# Altium schematic sheet Flyback_SMPS.SchDoc
size A; SheetNumber: 1; SheetTotal: 1
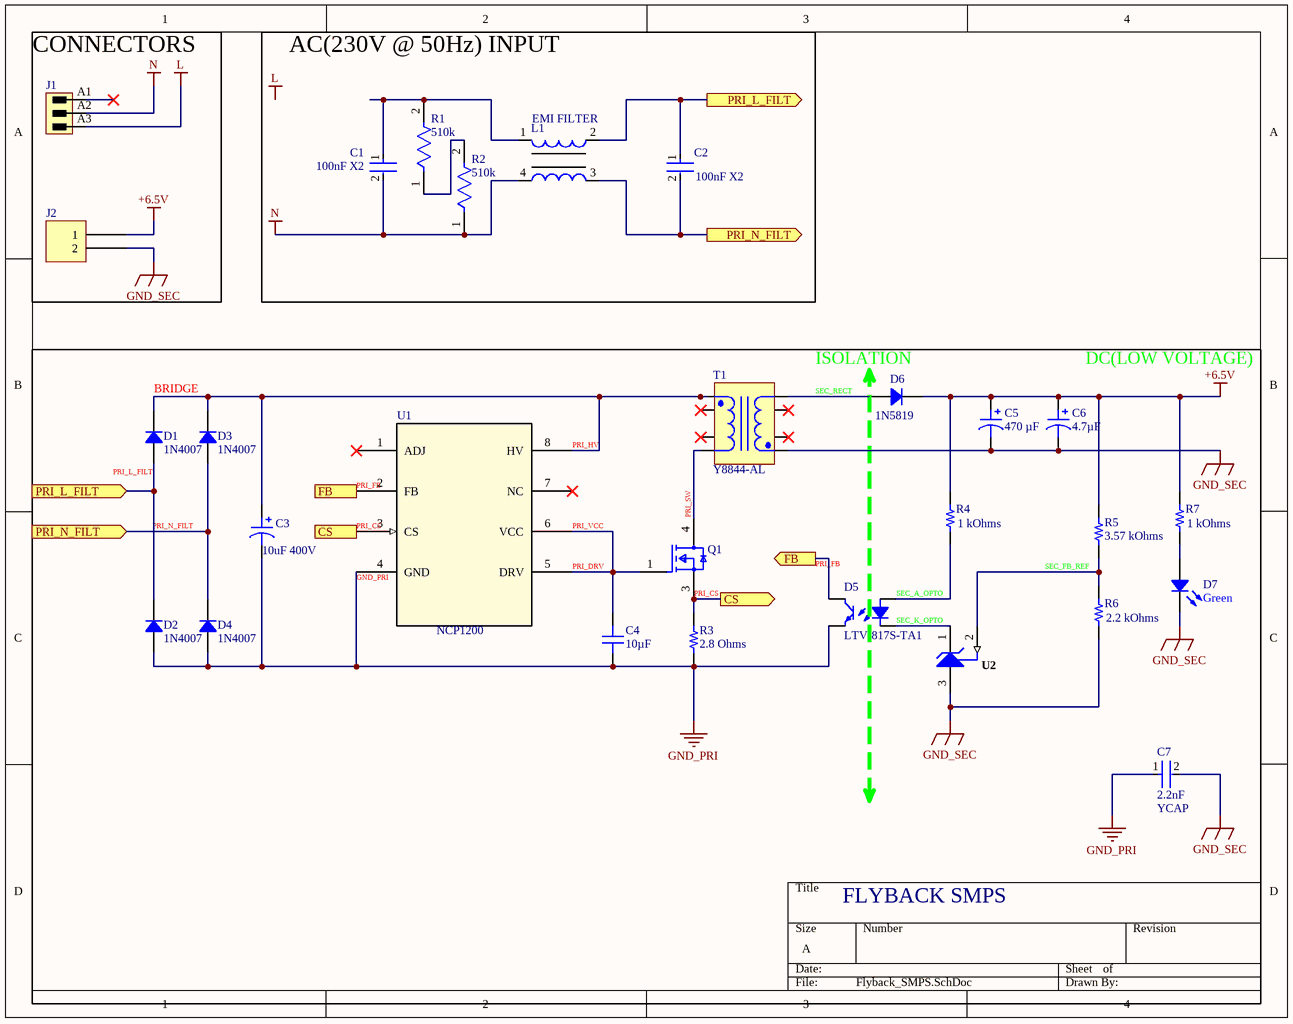
[diagram p0: Flyback_SMPS.SchDoc]

## Parts
C1  100nF X2  [FP-R46KI3100JBM1K-MFG]
C2  100nF X2  [FP-R46KI3100JBM1K-MFG]
C3  10uF 400V  [CAP TH ALUM ELEC D10.00mm S5.00mm H17.50mm]
C4  10µF  [CAP 1206_3216 - 1.8MM]
C5  470 µF  [CAP AL TH D8 L3.5 H12.5]
C6  4.7µF  [CAP TH ALUM ELEC D4.00mm S1.50mm H6.00mm]
C7  YCAP  value 2.2nF  [Vishay_0_MFG]
D1  1N4007  [SOD123F]
D2  1N4007  [SOD123F]
D3  1N4007  [SOD123F]
D4  1N4007  [SOD123F]
D5  LTV-817S-TA1  [LITEON LTV-817]
D6  1N5819  [SOD-123]
D7  Green  [LED 0603_1608 GREEN]
J1  1146740000  [SL_5_08HC_90_03]  (value not drawn)
J2  282837-2  [TE 282837-2]  (value not drawn)
L1  744823305  [WE-CMB-M]  (value not drawn)
Q1  STD1NK60T4  [STMicroelectronics_DPAK_TO-252_-0068772_MFG]  (value not drawn)
R1  510k  [FP-CR1206-IPC_A]
R2  510k  [FP-CR1206-IPC_A]
R3  2.8 Ohms  [RES 1206_3216]
R4  1 kOhms  [RES 0402_1005]
R5  value 3.57 kOhms  [YAGEO RES 1206_3216]  (hidden comment: 220 Ohms)
R6  2.2 kOhms  [RES 0402_1005]
R7  1 kOhms  [RES 0402_1005]
T1  Y8844-AL  [COIL-Y8844-AL-8_V]
U1  NCP1200  [SOIC8_ONS]
U2  TL431AQDBZRQ1  [DBZ0003A_L]  (value not drawn)

## Blocks framed on the sheet
CONNECTORS: J1 J2
AC(230V @ 50Hz) INPUT: C1 C2 L1 R1 R2
FLYBACK SMPS: C3-C7 D1-D7 Q1 R3-R7 T1 U1 U2

## Ports
CS (in, see Sheet1[3C]), CS (out, see Sheet1[1C]), FB (in, see Sheet1[3C]), FB (out, see Sheet1[1B]), PRI_L_FILT (in, see Sheet1[3A]), PRI_L_FILT (out, see Sheet1[1B]), PRI_N_FILT (in, see Sheet1[3A]), PRI_N_FILT (out, see Sheet1[1C])

## Nets
+6.5V: C5.1 C6.1 D6.2 J2.1 R4.2 R5.2 R7.2
GND_PRI: C3.2 C4.2 C7.1 D2.1 D4.1 D5.3 R3.1 U1.4(GND)
GND_SEC: C5.2 C6.2 C7.2 D7.2 J2.2 R6.1 T1.1 U2.3(ANODE)
L: J1.A3
N: C1.2 J1.A2 L1.4 R2.1
PRI_CS: Q1.3(S) R3.2 U1.3(CS) ; port CS
PRI_DRV: C4.1 Q1.1(G) U1.5(DRV) U1.6(VCC)
PRI_FB: D5.4 U1.2(FB) ; port FB
PRI_HV: C3.1 D1.2 D3.2 T1.8 U1.8(HV)
PRI_L_FILT: C2.1 D1.1 D2.2 L1.2 ; port PRI_L_FILT
PRI_N_FILT: C2.2 D3.1 D4.2 L1.3 ; port PRI_N_FILT
PRI_SW: Q1.4(D) T1.5
SEC_A_OPTO: D5.1 R4.1
SEC_FB_REF: R5.1 R6.2 U2.2(REF)
SEC_K_OPTO: D5.2 U2.1(CATHODE)
SEC_RECT: D6.1 T1.4
NetC1_1: C1.1 L1.1 R1.2
NetD7_1: D7.1 R7.1
NetR1_1: R1.1 R2.2

Not connected (* = marked no-connect by the designer): J1 A1*; T1 2* 3* 6* 7*; U1 1(ADJ)* 7(NC)*

## Notes on the sheet
- (near L1) EMI FILTER
- (near D6) ISOLATION
- (near C6) DC(LOW VOLTAGE)
- BRIDGE
- (near U1) PRI_VCC
- Labels drawn without touching a wire or pin: L

## Library data of the parts
C1 C2 = CMP-03022-000055-1: CAP FILM 0.1UF 10% 560VDC RADIAL; Dielectric: PP; Lead Diameter: 0.6mm; Voltage Rating (AC): 275V; Voltage Rating (DC): 560V; Mount: Through Hole; Capacitance: 100nF; Series: R46; Height - Seated (Max): 0.433inch; Depth: 5mm; Packaging: Bulk; RoHS Compliant: Yes; Case/Package: Radial; Ratings: X2; Termination: PC Pins; Tolerance: 10%; Lead Pitch: 15mm; Package Quantity: 2000; Dielectric Material: PP; Max Operating Temperature: 110°C; Height: 5mm; Min Operating Temperature: -40°C; Width: 11mm; Length: 18mm
C3 = 860241375002: CAP 10 UF 20% 400 V; manufacturer: Würth Elektronik; Capacitance: 10µF; Lifetime @ Temp.: 10000 Hrs @ 105°C; Polarization: Polar; Ripple Current @ High Frequency: 274mA @ 100kHz; Ripple Current @ Low Frequency: 137mA @ 120Hz; value: 10µF; Part Number: 860241375002; Applications: General Purpose; componentlink1description: Datasheet; componentlink1url: https://katalog.we-online.de/pbs/datasheet/860241375002.pdf; componentlink2description: DigiKey Link; componentlink2url: http://digikey.com/product-detail/en/w-rth-elektronik/860241375002/732-9301-1-ND/5729239; Device Package: Radial, Can; Height - Seated (Max): 0.689" (17.50mm); lastupdated: 9/2/2020 1:31:25 AM; Lead Spacing: 0.197" (5.00mm); Lifecycle Status: Active; Minimum Order: 1; Mounting Type: Through Hole; Operating Temperature: -25°C ~ 105°C; Package / Case: Radial, Can; packaging: TapeAndBox; partid: 12069; Part Status: Active; price: 0.48; series: WCAP-AT1H; Size / Dimension: 0.394" Dia (10.00mm); Supplier 1: DigiKey; Supplier Part Number 1: 732-9301-1-ND; Tolerance: ±20%; Voltage - Rated: 400V
C4 = 12065D106KAT2A: CAP CER 10UF 50V X5R 1206; manufacturer: AVX Corporation; Tolerance: ±10%; Part Number: 12065D106KAT2A; Capacitance: 10µF; Applications: General Purpose; componentlink1description: Datasheet; componentlink1url: http://datasheets.avx.com/cx5r.pdf; componentlink2description: DigiKey Link; componentlink2url: http://digikey.com/product-detail/en/avx-corporation/12065D106KAT2A/478-9979-1-ND/6149060; Device Package: 1206 (3216 Metric); lastupdated: 9/2/2020 1:05:35 AM; Lifecycle Status: Active; Minimum Order: 1; Mounting Type: Surface Mount, MLCC; Operating Temperature: -55°C ~ 85°C; Package / Case: 1206 (3216 Metric); packaging: TapeAndReel; partid: 21345; Part Status: Active; price: 0.16; series: -; Size / Dimension: 0.126" L x 0.063" W (3.20mm x 1.60mm); Supplier 1: DigiKey; Supplier Part Number 1: 478-9979-1-ND; Temperature Coefficient: X5R; Thickness (Max): 0.071" (1.80mm); value: 10µF; Voltage - Rated: 50V
C5 = UKW1C471MPD1TD: CAP ALUM 470UF 20% 16V RADIAL; manufacturer: Nichicon; Lifetime @ Temp.: 2000 Hrs @ 85°C; Polarization: Polar; Ripple Current @ Low Frequency: 420 mA @ 120 Hz; Part Number: UKW1C471MPD1TD; Applications: Audio; Capacitance: 470 µF; componentlink1description: Datasheet; componentlink1url: http://nichicon-us.com/english/products/pdfs/e-ukw.pdf; componentlink2description: DigiKey Link; componentlink2url: https://www.digikey.com/en/products/detail/nichicon/UKW1C471MPD1TD/4317336; Device Package: Radial, Can; Height - Seated (Max): 0.492" (12.50mm); lastupdated: 6/3/2024 8:06:12 PM; Lead Spacing: 0.138" (3.50mm); Lifecycle Status: Active; Minimum Order: 1; Mounting Type: Through Hole; Operating Temperature: -40°C ~ 85°C; Package / Case: Radial, Can; packaging: TapeAndBox; partid: 7216; Part Status: Active; price: 0.23; series: UKW; Size / Dimension: 0.315" Dia (8.00mm); Supplier 1: DigiKey; Supplier Part Number 1: 493-10758-1-ND; Tolerance: ±20%; value: 470 µF; Voltage - Rated: 16 V
C6 = UMP1C4R7MDD1TP: CAP ALUM 4.7UF 20% 16V RADIAL; manufacturer: Nichicon; Lifetime @ Temp.: 2000 Hrs @ 85°C; Polarization: Bi-Polar; Ripple Current @ High Frequency: 18mA @ 10kHz; Ripple Current @ Low Frequency: 12mA @ 120Hz; Part Number: UMP1C4R7MDD1TP; Applications: General Purpose; Capacitance: 4.7µF; componentlink1description: Datasheet; componentlink1url: http://nichicon-us.com/english/products/pdfs/e-ump.pdf; componentlink2description: DigiKey Link; componentlink2url: http://digikey.com/product-detail/en/nichicon/UMP1C4R7MDD1TP/493-10248-1-ND/4312507; Device Package: Radial, Can; Height - Seated (Max): 0.236" (6.00mm); lastupdated: 9/6/2020 1:48:30 AM; Lead Spacing: 0.059" (1.50mm); Lifecycle Status: Active; Minimum Order: 1; Mounting Type: Through Hole; Operating Temperature: -40°C ~ 85°C; Package / Case: Radial, Can; packaging: TapeAndBox; partid: 23164; Part Status: Active; price: 0.11; series: UMP; Size / Dimension: 0.157" Dia (4.00mm); Supplier 1: DigiKey; Supplier Part Number 1: 493-10248-1-ND; Tolerance: ±20%; value: 4.7µF; Voltage - Rated: 16V
C7 = CMP-001-00084-1: 2200 pF ±20% 500VAC Ceramic Capacitor Y5V (F) Radial, Disc; Manufacturer: Vishay; Symbol Hash: 02cd4be3c70576c341d710602a673aaf100b1e689dd796f6d4934cc5521dd216; Vac Y Rating: Y1; Voltage Rating: 1.5kV; Voltage Ac Rating X: 760V; Vac X Rating: X1; Verification Version: 0.0.0.3; Voltage Ac Rating Y: 500V; Tolerance: 20%; Datasheet Path: datasheets/Cap_Vishay_VY1222M37Y5VQ63V0_eec.pdf; Temperature Range High: 125°C; Automotive: No; helpURL: https://upverter.com/part/id/97ca20b8586b3509/; Lead Free: Yes; Temperature: -40°C to +125°C; Height: 24.5mm; ComponentLink2URL: https://www.vishay.com/docs/28537/vy1series.pdf; ComponentLink1URL: https://upverter.com/part/id/97ca20b8586b3509/; RoHS: TRUE; Mouser Description: VY1 Ceramic Capacitor 2 2NF 20% Y5V; Temperature Range Low: -40°C; Material: Ceramic; Digikey Part Number: BC3303-ND; Digikey Description: CAP CER 2200PF 500VAC Y5V RADIAL; Mouser Part Number: 72-VY1222M37Y5VQ63V0; Part Number: VY1222M37Y5VQ63V0; Case/Package: 0; Temperature Characteristic: Y5V; ComponentLink1Description: Upverter; ComponentLink2Description: Datasheet
D1-D4 = 1N4007FLTR: STANDARD RECTIFIER 1000V SOD-123; Manufacturer: SMC Diode Solutions; Capacitance @ Vr, F: 15pF @ 4V, 1MHz; Current - Average Rectified (Io): 1A; Current - Reverse Leakage @ Vr: 5µA @ 1000V; Speed: Standard Recovery >500ns, > 200mA (Io); Voltage - Forward (Vf) (Max) @ If: 1.1V @ 1A; Part Number: 1N4007FLTR; ComponentLink1Description: Datasheet; ComponentLink1URL: http://www.smc-diodes.com/propdf/1N4001FL-1N4007FL%20N1646%20REV.A.pdf; ComponentLink2Description: DigiKey Link; ComponentLink2URL: http://digikey.com/product-detail/en/smc-diode-solutions/1N4007FLTR/1655-1N4007FLCT-ND/11657827; Diode Type: Standard; LastUpdated: 8/30/2020 8:59:55 PM; Lifecycle Status: Active; Minimum Order: 1; Mounting Type: Surface Mount; Package / Case: SOD-123F; Packaging: TapeAndReel; PartId: 3314; Price: 0.01; Supplier 1: DigiKey; Supplier Part Number 1: 1655-1N4007FLCT-ND; Supplier Device Package: SOD-123FL; Voltage - DC Reverse (Vr) (Max): 1000V
D5 = LTV-817S-TA1: OPTOISOLATR 5KV TRANSISTOR 4-SMD; Manufacturer: Lite-On Inc.; Current - DC Forward (If) (Max): 50mA; Current Transfer Ratio (Max): 600% @ 5mA; Current Transfer Ratio (Min): 50% @ 5mA; Input Type: DC; Number of Channels: 1; Rise / Fall Time (Typ): 4µs, 3µs; Vce Saturation (Max): 200mV; Voltage - Forward (Vf) (Typ): 1.2V; Voltage - Isolation: 5000Vrms; Voltage - Output (Max): 35V; Part Number: LTV-817S-TA1; ComponentLink1Description: Datasheet; ComponentLink1URL: http://optoelectronics.liteon.com/upload/download/DS-70-96-0016/LTV-8X7%20series%20201610%20.pdf; ComponentLink2Description: DigiKey Link; ComponentLink2URL: http://digikey.com/product-detail/en/lite-on-inc/LTV-817S-TA1/160-1893-1-ND/3306757; Current - Output / Channel: 50mA; Device Package: 4-SMD, Gull Wing; LastUpdated: 1/12/2020 9:58:48 PM; Lifecycle Status: Active; Minimum Order: 1; Mounting Type: Surface Mount; Operating Temperature: -30°C ~ 110°C; Output Type: Transistor; Package / Case: 4-SMD, Gull Wing; Packaging: TapeAndReel; Part Status: Active; Price: 0.12; Series: -; Supplier 1: DigiKey; Supplier Part Number 1: 160-1893-1-ND; Supplier Device Package: 4-SMD
D6 = 1N5819HW-7-F: DIODE SCHOTTKY 40V 1A SOD123; Manufacturer: Diodes Incorporated; Capacitance @ Vr, F: 60pF @ 4V, 1MHz; Current - Reverse Leakage @ Vr: 1 mA @ 40 V; Speed: Fast Recovery =< 500ns, > 200mA (Io); Voltage - Forward (Vf) (Max) @ If: 450 mV @ 1 A; Part Number: 1N5819HW-7-F; ComponentLink1Description: Datasheet; ComponentLink1URL: https://www.diodes.com/assets/Datasheets/ds30217.pdf; ComponentLink2Description: DigiKey Link; ComponentLink2URL: https://www.digikey.com/en/products/detail/diodes-incorporated/1N5819HW-7-F/814970; Current - Average Rectified (Io): 1A; Diode Type: Schottky; LastUpdated: 6/3/2024 7:54:46 PM; Lifecycle Status: Active; Minimum Order: 1; Mounting Type: Surface Mount; Operating Temperature - Junction: -65°C ~ 125°C; Package / Case: SOD-123; Packaging: TapeAndReel; PartId: 2212; Part Status: Active; Price: 0.05; Series: -; Supplier 1: DigiKey; Supplier Part Number 1: 1N5819HW-FDICT-ND; Supplier Device Package: SOD-123; Voltage - DC Reverse (Vr) (Max): 40 V
D7 = LT Q99G.01-R2T1-25-1: NEXT GENERATION OF CHIP LED 0603; Manufacturer: ams-OSRAM USA Inc.; Current - Test: 5mA; Lens Color: Colorless; Lens Size: 1.10mm x 0.80mm; Lens Style: Rectangle with Flat Top; Lens Transparency: Clear; Millicandela Rating: 247.5mcd; Viewing Angle: 140°; Voltage - Forward (Vf) (Typ): 2.9V; Wavelength - Dominant: 530nm; Wavelength - Peak: 518nm; Part Number: LT Q99G.01-R2T1-25-1; Color: Green; ComponentLink2Description: DigiKey Link; ComponentLink2URL: https://www.digikey.com/en/products/detail/ams-osram-usa-inc/LT-Q99G-01-R2T1-25-1/21556499; Device Package: 0603 (1608 Metric); Height (Max): 0.75mm; LastUpdated: 8/25/2025 8:35:06 PM; Lifecycle Status: Active; Minimum Order: 1; Mounting Type: Surface Mount; Package / Case: 0603 (1608 Metric); Packaging: TapeAndReel; PartId: 1419; Price: 0.03; Series: Chip LED 0603; Size / Dimension: 1.60mm L x 0.80mm W; Supplier 1: DigiKey; Supplier Part Number 1: 475-LTQ99G.01-R2T1-25-1CT-ND; Supplier Device Package: 0603; Value: Green
J1 = CMP-1559-01016-1: OMNIMATE Signal - series BL/SL 5.08; Manufacturer: Weidmueller; Rated_voltage_for_surge_voltage_class_pollution_degree_II_2: 400 V; No_of_poles: 3; Contact_material: Cu-Leg; Rated_current_use_group_B_UL_1059: 15 A; Mounting_onto_the_PCB: Solder connection; Side_termination_characteristic: open side; Pitch_inch: 0.2 inch; Contact_surface: tinned; Pitch_mm: 5.08 mm; UL_94_flammability_rating: V-0; Insulating_material: PA GF; Outgoing_elbow: 90°; Solder_pin_length_mm: 3.2 mm; Short_text_for_material: SL 5.08HC/03/90 3.2SN OR BX; Rated_voltage_use_group_B_UL_1059: 300 V; ComponentLink1Description: Manufacturer URL; PackageReference: SL_5_08HC_90_03; ComponentLink2Description: URL Link1; Revision: V1; ComponentLink1URL: http://www.weidmueller.com/; Colour: Orange; PartNumber: 1146740000; ComponentLink2URL: http://catalog.weidmueller.com/catalog/Start.do?localeId=en&ObjectID=1146740000; Qty: 100 PCS; Packaging: Box
J2 = 282837-2: TERM BLK 2P SIDE ENT 5.08MM PCB; Manufacturer: TE Connectivity AMP Connectors; Current: 13.5 A; Mating Orientation: Horizontal with Board; Number of Levels: 1; Pitch: 0.200" (5.08mm); Positions Per Level: 2; Voltage: 300 V; Wire Gauge: 16-28 AWG; Wire Termination: Screw - Rising Cage Clamp; Part Number: 282837-2; Color: Green; ComponentLink1Description: Datasheet; ComponentLink1URL: https://www.te.com/commerce/DocumentDelivery/DDEController?Action=srchrtrv&DocNm=282837&DocType=Customer+Drawing&DocLang=English; ComponentLink2Description: DigiKey Link; ComponentLink2URL: https://www.digikey.com/en/products/detail/te-connectivity-amp-connectors/282837-2/2187973; Features: Interlocking (Side); LastUpdated: 6/21/2022 3:00:23 PM; Lifecycle Status: Active; Minimum Order: 1; Mounting Type: Through Hole; Packaging: Tray; Part Status: Active; Price: 0.31; Series: Buchanan; Supplier 1: DigiKey; Supplier Part Number 1: A113320-ND
L1 = 744823305: THT Common Mode Power Line Choke WE-CMB, L = 5.00 mH; Inductance: 5.00 mH; ComponentLink1Description: Manufacturer Link; ComponentLink2Description: Datasheet; DatasheetVersion: ver 7, Nov-2006; ComponentLink1URL: http://www.we-online.com; PackageVersion: 2006; PackageDescription: THT Inductor, 4-Leads, Body 25.0 x 17.0 mm; ComponentLink2URL: http://www.we-online.de/katalog/media/pdf/744823305.pdf; PackageReference: WE-CMB-M; PartNumber: 744823305
Q1 = CMP-007-000000-1: N-Channel 600V 1A (Tc) 30W (Tc) Surface Mount DPAK; Manufacturer: STMicroelectronics; Max Junction Temp: +150°C; Threshold Vgs Min: 2.25V; Drain To Source Resistance: 7.3Ω; Gate To Source Voltage: 30V; Depletion Mode: False; Pulse Drain Current: 4A; Number Of N Channels: 1; Input Capacitace At Vds: 156pF @ 25V; Turn On Delay Time: 6.5ns; Verification Version: 0.0.0.3; Threshold Vgs: 3V; Gate Charge At Vgs: 7nC @ 10V; Reverse Recovery Charge: 240nC; Turn Off Delay Time: 19ns; Max Forward Diode Voltage: 1.6V; Symbol Hash: 86656c45bbbddc162aead764a772c09aa28df33f5023c6f9e1f954939099aa0e; Reverse Recovery Time: 140ns; Rthja Max: 100°C/W; Threshold Vgs Max: 3.7V; Standoff Height: 0.03mm; Digikey Part Number: 497-2483-1-ND; Mouser Part Number: 511-STD1NK60; ComponentLink1Description: Upverter; Part Number: STD1NK60T4; Height: 2.63mm; Lead Free: Yes; Digikey Description: MOSFET N-CH 600V 1A DPAK; RoHS: TRUE; ComponentLink1URL: https://upverter.com/part/id/826df9c6efb694a8/; ComponentLink2URL: https://www.st.com/resource/en/datasheet/std1nk60t4.pdf; Power Dissipation: 30W; Package: DPAK(TO-252)-0068772; Temperature Range High: 150°C; helpURL: https://upverter.com/part/id/826df9c6efb694a8/; Drain To Source Breakdown Voltage: 600V; Datasheet Path: datasheets/Trans_STMicroelectronics_STD1NK60T4_eec.pdf; Number Of Channels: 1; Temperature: -55°C to +150°C; Temperature Range Low: -55°C; Drain To Source Voltage: 600V; Continuous Drain Current: 1A; ComponentLink2Description: Datasheet; Mouser Description: MOSFET N-Ch 600 Volt 1.0Amp Zener SuperMESH; Technology: MOSFET; Automotive: No
R1 R2 = CMP-07231-002024-1: Thick Film Chip Resistors 1206 510kΩ 0.25W 5% 200ppm/°C; Resistance: 510kR; Voltage Rating: 200V; Power Rating: 250mW; Length: 3.2mm; Min Operating Temperature: -55°C; Max Operating Temperature: 155°C; Composition: Thick Film; Mount: Surface Mount; Case Code (Imperial): 1206; Contact Plating: Tin; Packaging: Tape and Reel; Package Quantity: 5000; Military Standard: Not; Temperature Coefficient: 200ppm/°C; Width: 1.6mm; Depth: 1.6mm; Thickness: 610um; Tolerance: 5%; Case/Package: 1206; Radiation Hardening: No; Case Code (Metric): 3216; Termination: SMD/SMT; Height: 0.6mm
R3 = CPF1206B2R8E1: CPF 1206 2R8 0.1% 25PPM 1K RL; Manufacturer: TE Connectivity Passive Product; Power (Watts): 0.125W, 1/8W; Temperature Coefficient: ±25ppm/°C; Part Number: CPF1206B2R8E1; ComponentLink1Description: Datasheet; ComponentLink1URL: https://www.te.com/commerce/DocumentDelivery/DDEController?Action=srchrtrv&DocNm=1773200&DocType=DS&DocLang=English; ComponentLink2Description: DigiKey Link; ComponentLink2URL: https://www.digikey.com/en/products/detail/te-connectivity-passive-product/CPF1206B2R8E1/14006927; Composition: Thin Film; Device Package: 1206 (3216 Metric); Height - Seated (Max): 0.026" (0.65mm); LastUpdated: 2/9/2024 8:53:26 PM; Lifecycle Status: Active; Minimum Order: 1; Number of Terminations: 2; Operating Temperature: -55°C ~ 155°C; Package / Case: 1206 (3216 Metric); Packaging: TapeAndReel; PartId: 58938; Part Status: Active; Price: 0.16; Resistance: 2.8 Ohms; Series: CPF; Size / Dimension: 0.120" L x 0.061" W (3.05mm x 1.55mm); Supplier 1: DigiKey; Supplier Part Number 1: 1712-CPF1206B2R8E1CT-ND; Supplier Device Package: 1206; Tolerance: ±0.1%; Value: 2.8 Ohms
R4 R7 = CPF0402B1K0E: RES SMD 1K OHM 0.1% 1/16W 0402; Manufacturer: TE Connectivity Passive Product; Power (Watts): 0.063W, 1/16W; Temperature Coefficient: ±25ppm/°C; Part Number: CPF0402B1K0E; Value: 1 kOhms; ComponentLink1Description: Datasheet; ComponentLink1URL: https://www.te.com/commerce/DocumentDelivery/DDEController?Action=srchrtrv&DocNm=1773200&DocType=DS&DocLang=English; ComponentLink2Description: DigiKey Link; ComponentLink2URL: https://www.digikey.com/en/products/detail/te-connectivity-passive-product/CPF0402B1K0E/4966468; Composition: Thin Film; Device Package: 0402 (1005 Metric); Height - Seated (Max): 0.014" (0.35mm); LastUpdated: 2/9/2024 8:30:24 PM; Lifecycle Status: Active; Minimum Order: 1; Number of Terminations: 2; Operating Temperature: -55°C ~ 155°C; Package / Case: 0402 (1005 Metric); Packaging: TapeAndReel; PartId: 2470; Part Status: Active; Price: 0.10; Resistance: 1 kOhms; Series: CPF, Neohm; Size / Dimension: 0.039" L x 0.020" W (1.00mm x 0.50mm); Supplier 1: DigiKey; Supplier Part Number 1: A119928CT-ND; Supplier Device Package: 0402; Tolerance: ±0.1%
R5 = RC0402FR-073K57L: RES 3.57K OHM 1% 1/16W 0402; Manufacturer: Yageo; Power (Watts): 0.063W, 1/16W; Temperature Coefficient: ±100ppm/°C; Part Number: RC0402FR-073K57L; ComponentLink1Description: Datasheet; ComponentLink1URL: https://www.yageo.com/upload/media/product/productsearch/datasheet/rchip/PYu-RC_Group_51_RoHS_L_10.pdf; ComponentLink2Description: DigiKey Link; ComponentLink2URL: https://www.digikey.com/en/products/detail/yageo/RC0402FR-073K57L/5281010; Composition: Thick Film; Device Package: 0402 (1005 Metric); Features: Moisture Resistant; Height - Seated (Max): 0.016" (0.40mm); LastUpdated: 8/31/2025 3:04:18 PM; Lifecycle Status: Active; Minimum Order: 1; Number of Terminations: 2; Operating Temperature: -55°C ~ 155°C; Package / Case: 0402 (1005 Metric); Packaging: CutTape; PartId: 2603; Part Status: Active; Price: 0.01; Resistance: 3.57 kOhms; Series: RC_L; Size / Dimension: 0.039" L x 0.020" W (1.00mm x 0.50mm); Supplier 1: DigiKey; Supplier Part Number 1: YAG3150CT-ND; Supplier Device Package: 0402; Tolerance: ±1%
R6 = RR0510P-222-D: RES SMD 2.2K OHM 0.5% 1/16W 0402; Manufacturer: Susumu; Power (Watts): 0.063W, 1/16W; Temperature Coefficient: ±25ppm/°C; Part Number: RR0510P-222-D; Value: 2.2 kOhms; ComponentLink1Description: Datasheet; ComponentLink1URL: http://www.susumu.co.jp/common/pdf/n_catalog_partition05_en.pdf; ComponentLink2Description: DigiKey Link; ComponentLink2URL: https://www.digikey.com/en/products/detail/susumu/RR0510P-222-D/432405; Composition: Thin Film; Device Package: 0402 (1005 Metric); Height - Seated (Max): 0.016" (0.40mm); LastUpdated: 2/9/2024 8:30:21 PM; Lifecycle Status: Active; Minimum Order: 1; Number of Terminations: 2; Operating Temperature: -55°C ~ 125°C; Package / Case: 0402 (1005 Metric); Packaging: TapeAndReel; PartId: 3229; Part Status: Active; Price: 0.01; Resistance: 2.2 kOhms; Series: RR; Size / Dimension: 0.039" L x 0.020" W (1.00mm x 0.50mm); Supplier 1: DigiKey; Supplier Part Number 1: RR05P2.2KDCT-ND; Tolerance: ±0.5%
T1 = Y8844-AL: Flyback Transformer, 3.5 W, -40 to 85 degC, 18.3 x 20.1 x 14 mm Package; Manufacturer: Coilcraft; Leakage inductance max (uH): 26; Isolation (Vrms): 1500; DCR max (Ohms): 4.25 (8-5) 0.07 (4-1); Output: 6.5 V, 0.54 A; Inductance +/-10% (mH): 2.9; ComponentLink1Description: Manufacturer URL; ComponentLink2Description: Datasheet; DatasheetVersion: 31/01/2005; ComponentLink3Description: Package Specification; Mounting Technology: Through Hole; ComponentLink3URL: http://www.coilcraft.com/pdf_viewer/showpdf.cfm?f=pdf_store:y8844.pdf; Operating Temperature Range: -40 to 85 degC; ComponentLink1URL: http://www.coilcraft.com/; ComponentLink2URL: http://www.coilcraft.com/pdf_viewer/showpdf.cfm?f=pdf_store:y8844.pdf; Application: 3.5 W; PartNumber: Y8844-AL; PackageDescription: 8-Pin Through Hole Package, Body 18.3 x 20.1 mm; PackageReference: Y8844-AL-8
U1 = NCP1200AD100R2: No Description Available; Manufacturer_Name: onsemi; Copyright: Copyright (C) 2025 Ultra Librarian. All rights reserved.; Manufacturer_Part_Number: NCP1200AD100R2; RefDes: RefDes; Type: Type
U2 = TL431AQDBZRQ1: Automotive Catalog Adjustable Precision Shunt Regulator, 34 ppm / degC, 100 mA, -40 to 125 degC, 3-pin SOT-23 (DBZ), Green (RoHS & no Sb/Br); Manufacturer: Texas Instruments; Iout/Iz(Max)(mA): 100; Initial Accuracy @ 25/deg C(%): 1; SubFamily: Shunt Voltage Reference; VO Adj(Max)(V): 36; VO Adj(Min)(V): 2.495; Temp Coeff(Typ)(ppm/ degree C): 34; Min Iz for Regulation(uA): 600; Eco-Plan: Green (RoHS & no Sb/Br); PartNumber: TL431AQDBZRQ1; ComponentLink1Description: Manufacturer URL; ComponentLink2Description: Datasheet; DatasheetVersion: SGLS302C; ComponentLink3URL: http://www.ti.com/litv/pdf/mpds108a; ComponentLink1URL: http://www.ti.com/; Code_JEDEC: TO-236; ComponentLink2URL: http://www.ti.com/general/docs/lit/getliterature.tsp?genericPartNumber=TL431A-Q1&fileType=pdf; PackageReference: DBZ0003A; ComponentLink3Description: Package Specification; PackageVersion: 4203227/B; Rating: Automotive; Mounting Technology: Surface Mount; PackageDescription: 3-Pin Plastic Small Outline, Body 2.92 x 1.3 mm, Pitch 0.95 mm